# Altium schematic sheet Ext_Regulators.SchDoc
size A
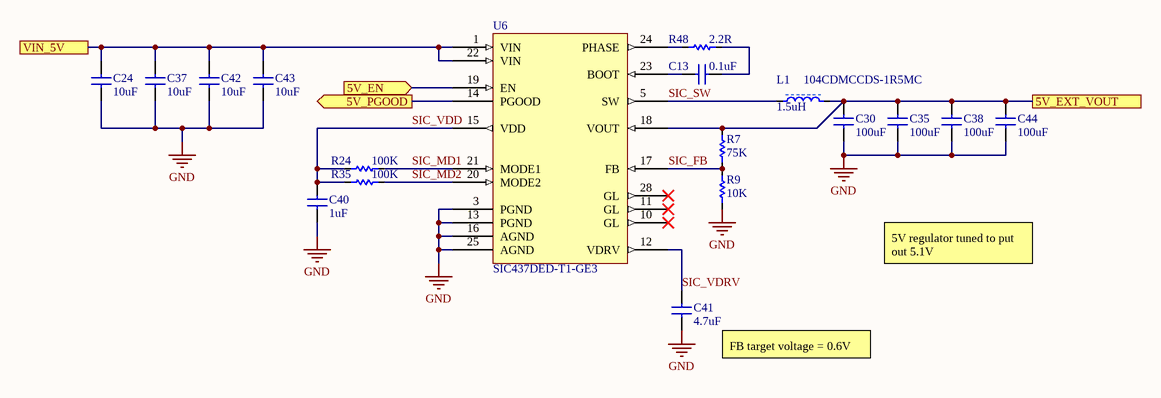
[diagram p0: Ext_Regulators.SchDoc]

## Parts
C13  value 0.1uF  [0402_CAPACITOR]  (hidden comment: CAP 0.1uF 16V X7R)
C24  value 10uF  [0805_Capacitor]  (hidden comment: CAP 10uF 25V X5R)
C30  value 100uF  [1210_Capacitor]  (hidden comment: C3225X5R0J107M250AC)
C35  value 100uF  [1210_Capacitor]  (hidden comment: C3225X5R0J107M250AC)
C37  value 10uF  [0805_Capacitor]  (hidden comment: CAP 10uF 25V X5R)
C38  value 100uF  [1210_Capacitor]  (hidden comment: C3225X5R0J107M250AC)
C40  value 1uF  [0603_CAPACITOR]  (hidden comment: CAP 1uF 16V X7R)
C41  value 4.7uF  [0805_Capacitor]  (hidden comment: CAP 4.7uF 16V X5R)
C42  value 10uF  [0805_Capacitor]  (hidden comment: CAP 10uF 25V X5R)
C43  value 10uF  [0805_Capacitor]  (hidden comment: CAP 10uF 25V X5R)
C44  value 100uF  [1210_Capacitor]  (hidden comment: C3225X5R0J107M250AC)
L1  104CDMCCDS-1R5MC  value 1.5uH  [L_104CDMCCDS]
R7  value 75K  [0402_Resistor]  (hidden comment: R_0402_75K_1%)
R9  value 10K  [0402_Resistor]  (hidden comment: R_0402_10K_1%)
R24  value 100K  [0402_Resistor]  (hidden comment: R_0402_100K_1%)
R35  value 100K  [0402_Resistor]  (hidden comment: R_0402_100K_1%)
R48  value 2.2R  [0402_Resistor]  (hidden comment: R_0402_2.2R_1%)
U6  SIC437DED-T1-GE3  [U_MLP44-24L]

## Ports
5V_EN (in), 5V_EXT_VOUT, 5V_PGOOD (out), VIN_5V

## Nets
GND: C24.2 C30.2 C35.2 C37.2 C38.2 C40.2 C41.2 C42.2 C43.2 C44.2 R9.1 U6.3(PGND) U6.13(PGND) U6.16(AGND) U6.25(AGND)
5V_EN: U6.19(EN) ; port 5V_EN
5V_EXT_VOUT: C30.1 C35.1 C38.1 C44.1 L1.2 R7.2 U6.18(VOUT) ; port 5V_EXT_VOUT
5V_PGOOD: U6.14(PGOOD) ; port 5V_PGOOD
SIC_FB: R7.1 R9.2 U6.17(FB)
SIC_MD1: R24.1 U6.21(MODE1)
SIC_MD2: R35.1 U6.20(MODE2)
SIC_SW: L1.1 U6.5(SW)
SIC_VDD: C40.1 R24.2 R35.2 U6.15(VDD)
SIC_VDRV: C41.1 U6.12(VDRV)
VIN_5V: C24.1 C37.1 C42.1 C43.1 U6.1(VIN) U6.22(VIN) ; port VIN_5V
NetC13_1: C13.1 R48.2
NetC13_2: C13.2 U6.23(BOOT)
NetR48_1: R48.1 U6.24(PHASE)

Not connected (* = marked no-connect by the designer): U6 10(GL)* 11(GL)* 28(GL)*

## Notes on the sheet
- 5V regulator tuned to put out 5.1V
- (near C41) FB target voltage = 0.6V

## Library data of the parts
C13 = C_0402_0.1uF_16V_10%: CAP CERM 0.1uF 10% 16V 0402; Package: =SelectedPackage; Voltage: 16V; Temperature Coefficient: X7R; Supplier 1: Digi-Key; Supplier Part Number 1: 1276-1001-1-ND; Supplier 2: Digi-Key; Supplier Part Number 2: 587-1451-1-ND
C24 C37 C42 C43 = C_0805_10uF_25V_10%: CAP CER 10UF 25V X5R 0805; Package: =SelectedPackage; Voltage: 25V; Temperature Coefficient: X5R; Supplier 1: Digi-Key; Supplier Part Number 1: 1276-2891-1-ND
C30 C35 C38 C44 = C_1210_100uF_6.3V_20%: CAP CER 100UF 6.3V 20% X5R 1210; SVP Creator: Spencer Berglund; Package: 1210; Supplier 1: Digi-Key; Supplier Part Number 1: 445-1437-1-ND
C40 = C_0603_1uF_16V_10%: CAP CERM 1uF 10% 16V 0603; SVP Creator: Spencer Berglund; Package: =SelectedPackage; Voltage: 16V; Temperature Coefficient: X7R; Supplier 1: Digi-Key; Supplier Part Number 1: 1276-6524-6-ND
C41 = C_0805_4.7uF_16V_10%: CAP CERM 4.7uF 10% 16V 0805; SVP Creator: Spencer Berglund; Package: =SelectedPackage; Voltage: 16V; Temperature Coefficient: X5R; Supplier 1: Digi-Key; Supplier Part Number 1: 1276-1065-6-ND
L1 = L_104CDMCCDS-1R5MC: 1.5µH Shielded Molded Inductor 19A 4.2mOhm Max Nonstandard; Manufacturer: Sumida; DC Resistance (DCR): 4.2mR; Core Material: Metal; Saturation Current: 29A; Test Frequency: 100kHz; Tolerance: 20%; Supplier 1: Digi-Key; Supplier 2: Mouser; Supplier Part Number 1: 308-2497-1-ND; Supplier Part Number 2: 851-104CDMCCDS-1R5MC; Manufacturer Part Number: 104CDMCCDS-1R5MC; Inductance: 1.5uH; Current Rating: 19A; Min Operating Temperature: -55°C; Max Operating Temperature: 125°C
R7 R9 R24 R35 R48 = R_0402_generic_1%: Generic 0402 Resistor (10.2R to 10M); Manufacturer: Yageo; Power Rating: 0.0625W; Temperature Coefficient: ±100ppm/°C; Tolerance: ±1%; Voltage Rating: 50V; Operating Temperature: -55°C ~ 155°C; Manufacturer Part Number: ='RC0402FR-07'+ValueFormatted+'L'; HelpURL: https://www.digikey.com/products/en/resistors/chip-resistor-surface-mount/52?pv17=103&FV=fffc000d%2Cc0001%2C1c0002%2C1f140000%2Cffe00034&k=RC0402; ValueFormatted: =Copy(Copy(Value, 0, Pos('.', Value)-1)+Copy(Value, Length(Value), 1)+Copy(Value, Pos('.', Value)+1, Length(Value)-Pos('.', Value)-1),1,Pos('.',Value)*Length(Value))+Copy(Value,1,Length(Value)*(1-Pos('.',Value)))
U6 = U_SIC437DED: Buck Switching Regulator IC Positive Adjustable 0.6V 1 Output 12A 24-PowerWFQFN; Manufacturer: Vishay; Supplier 1: Digi-Key; Supplier 2: Mouser; Supplier Part Number 1: SIC437DED-T1-GE3CT-ND; Supplier Part Number 2: 78-SIC437DED-T1-GE3; Manufacturer Part Number: SIC437DED-T1-GE3